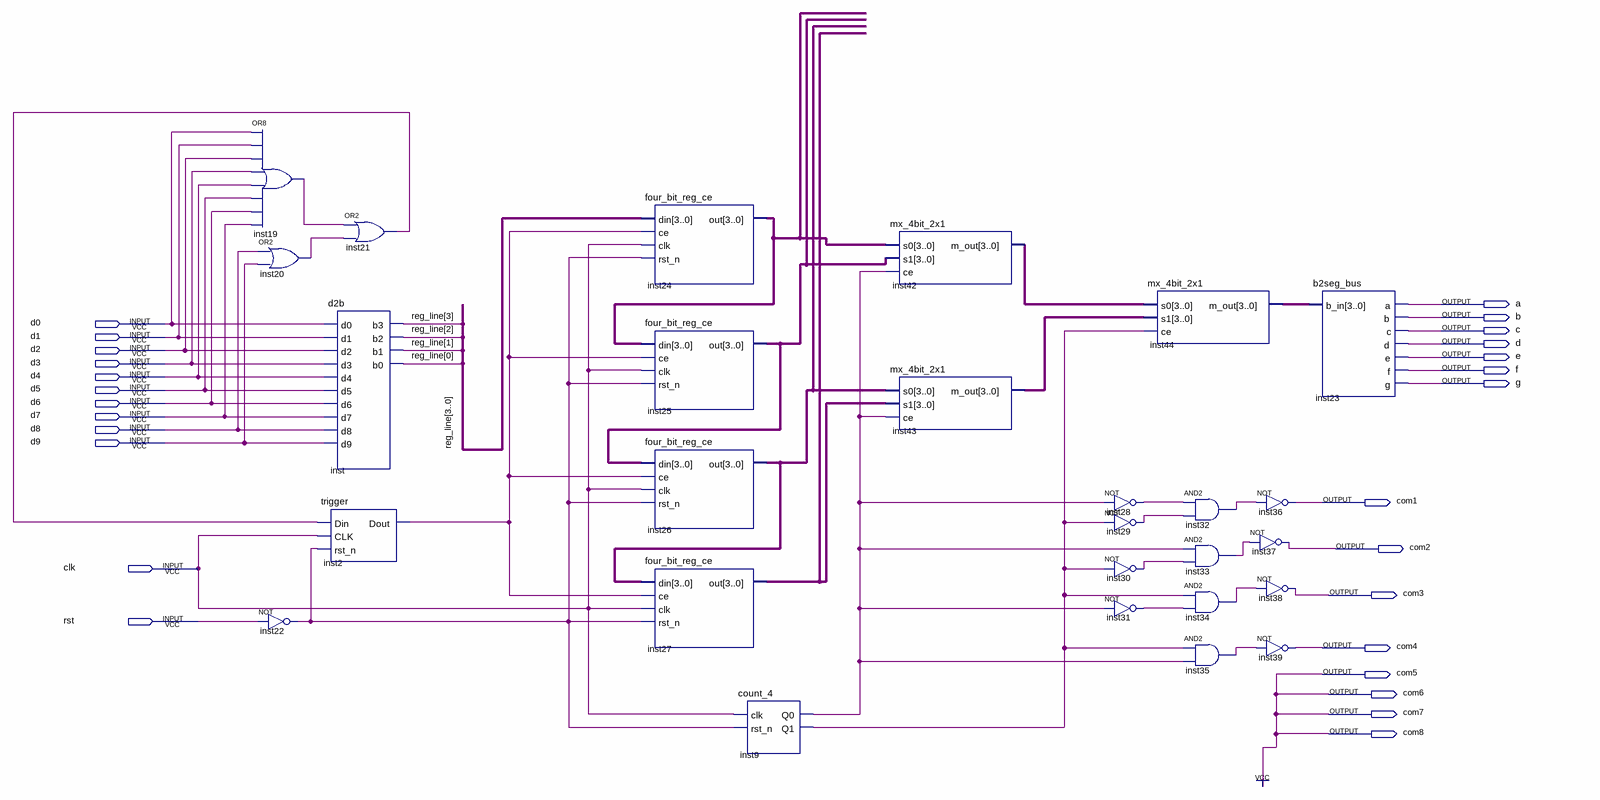
[diagram p0: schematic sheet]
// Quartus schematic week10.bdf as structural Verilog: 27 symbols, 27 pins
module week10 (
  input  d0,
  input  d1,
  input  d2,
  input  d3,
  input  d4,
  input  d5,
  input  d6,
  input  d7,
  input  d8,
  input  d9,
  input  clk,
  input  rst,
  output a,
  output b,
  output c,
  output d,
  output e,
  output f,
  output g,
  output com1,
  output com2,
  output com3,
  output com4,
  output com5,
  output com6,
  output com7,
  output com8
);

  wire inst2_dout, inst9_q0, inst9_q1, inst19_out, inst20_out, inst21_out, inst22_out, inst28_out,
       inst29_out, inst30_out, inst31_out, inst32_out, inst33_out, inst34_out, inst35_out;
  wire [3:0] inst24_out, inst25_out, inst26_out, inst27_out, inst42_m_out, inst43_m_out, inst44_m_out,
       reg_line;

  or inst19 (inst19_out, d0, d1, d2, d3, d4, d5, d6, d7);
  or inst20 (inst20_out, d8, d9);
  not inst22 (inst22_out, rst);
  or inst21 (inst21_out, inst19_out, inst20_out);
  d2b inst (
    .d0(d0), .d1(d1), .d2(d2), .d3(d3), .d4(d4), .d5(d5), .d6(d6), .d7(d7), .d8(d8), .d9(d9),
    .b3(reg_line[3]), .b2(reg_line[2]), .b1(reg_line[1]), .b0(reg_line[0]));
  trigger inst2 (.Din(inst21_out), .CLK(clk), .rst_n(inst22_out), .Dout(inst2_dout));
  four_bit_reg_ce inst24 (.din(reg_line), .ce(inst2_dout), .clk(clk), .rst_n(inst22_out), .out(inst24_out));
  four_bit_reg_ce inst25 (.din(inst24_out), .ce(inst2_dout), .clk(clk), .rst_n(inst22_out), .out(inst25_out));
  four_bit_reg_ce inst26 (.din(inst25_out), .ce(inst2_dout), .clk(clk), .rst_n(inst22_out), .out(inst26_out));
  four_bit_reg_ce inst27 (.din(inst26_out), .ce(inst2_dout), .clk(clk), .rst_n(inst22_out), .out(inst27_out));
  count_4 inst9 (.clk(clk), .rst_n(inst22_out), .Q0(inst9_q0), .Q1(inst9_q1));
  mx_4bit_2x1 inst42 (.s0(inst24_out), .s1(inst25_out), .ce(inst9_q0), .m_out(inst42_m_out));
  mx_4bit_2x1 inst43 (.s0(inst26_out), .s1(inst27_out), .ce(inst9_q0), .m_out(inst43_m_out));
  not inst28 (inst28_out, inst9_q0);
  not inst29 (inst29_out, inst9_q1);
  not inst30 (inst30_out, inst9_q1);
  not inst31 (inst31_out, inst9_q0);
  mx_4bit_2x1 inst44 (.s0(inst42_m_out), .s1(inst43_m_out), .ce(inst9_q1), .m_out(inst44_m_out));
  and inst32 (inst32_out, inst28_out, inst29_out);
  and inst33 (inst33_out, inst9_q0, inst30_out);
  and inst34 (inst34_out, inst9_q1, inst31_out);
  and inst35 (inst35_out, inst9_q1, inst9_q0);
  not inst36 (com1, inst32_out);
  not inst37 (com2, inst33_out);
  not inst38 (com3, inst34_out);
  not inst39 (com4, inst35_out);
  b2seg_bus inst23 (.b_in(inst44_m_out), .a(a), .b(b), .c(c), .d(d), .e(e), .f(f), .g(g));

  assign com5 = 1'b1;
  assign com6 = 1'b1;
  assign com7 = 1'b1;
  assign com8 = 1'b1;
endmodule
